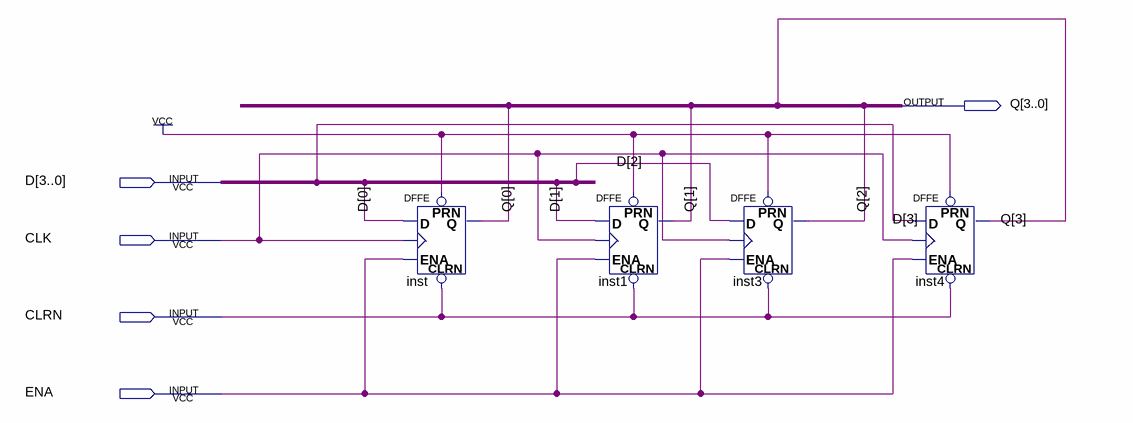
[diagram p0: schematic sheet]
// Quartus schematic REGISTRADOR4bits.bdf as structural Verilog: 4 symbols, 5 pins
module REGISTRADOR4bits (
  input  [3:0] D,
  input  CLK,
  input  CLRN,
  input  ENA,
  output [3:0] Q
);

  DFFE inst (.PRN(1'b1), .CLRN(CLRN), .D(D[0]), .CLK(CLK), .ENA(ENA), .Q(Q[0]));
  DFFE inst1 (.PRN(1'b1), .CLRN(CLRN), .D(D[1]), .CLK(CLK), .ENA(ENA), .Q(Q[1]));
  DFFE inst3 (.PRN(1'b1), .CLRN(CLRN), .D(D[2]), .CLK(CLK), .ENA(ENA), .Q(Q[2]));
  DFFE inst4 (.PRN(1'b1), .CLRN(CLRN), .D(D[3]), .CLK(CLK), .ENA(ENA), .Q(Q[3]));
endmodule
